# EAGLE design RL_P (EAGLE 9.6.2)
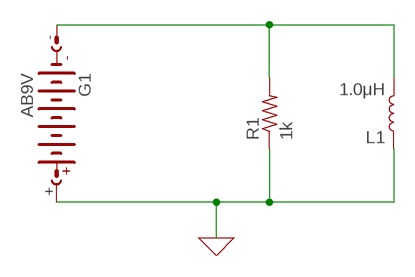
[diagram p0: schematic, sheet 1]

## Parts
G1  AB9V  [AB9V]
L1  1.0μH  1.0μH-0805_WIDE-1.0μH-1.4A-0.07OHM-1.4MM_H  [0805-WIDE]
R1  1k  R-US_0204/2V  [0204V]

## Nets
0: G1.+ L1.1 R1.1 ; supply symbol labelled GND
N$1: G1.- L1.2 R1.2

## Library data of the parts
G1 = battery:AB9V: 9-V BATTERY CLIP
L1 = SparkFun-Coils:1.0μH: 1.0μH Inductor Resist changes in electrical current. Basically a coil of wire. SparkFun Products: SparkFun Edge <https://www.sparkfun.com/products/15170>; PROD_ID: NDUC-14237
R1 = adafruit:R-US_: RESISTOR, American symbol

## Board
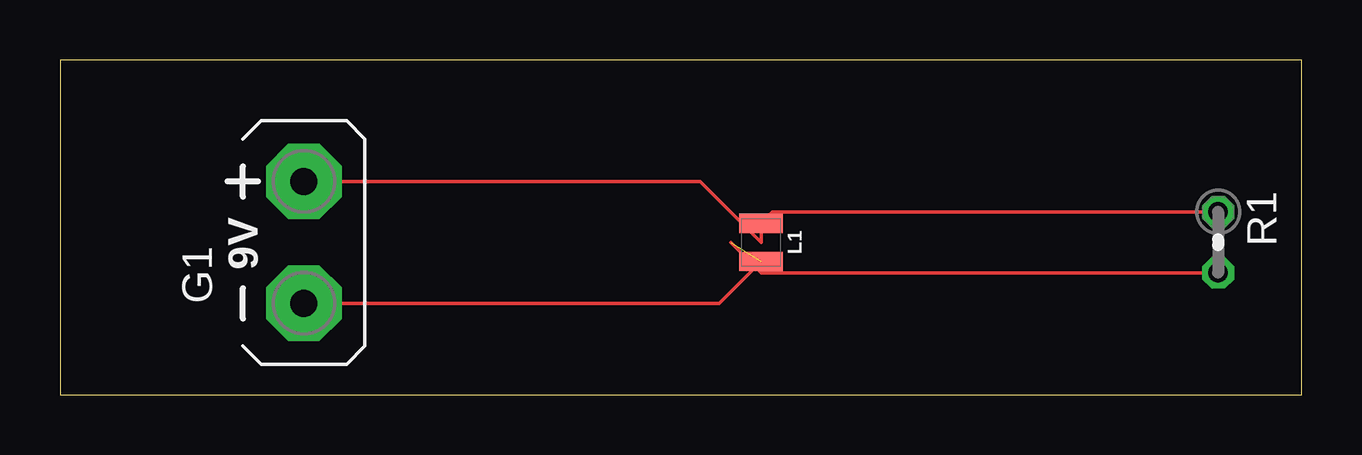
[diagram p1: board, top side]

Size 51.74 x 13.96 mm. Coordinates in mm from the lower left corner, seen from the top.
Outline: 0,0 51.74,0 51.74,13.96 0,13.96 0,0
Copper layers (1*16): Top 0.035mm / dielectric 1.5mm / Bottom 0.035mm
Design rules "default": minimum track width 6mil, minimum drill 0.35mm, track to track 6mil, track to pad 6mil, pad to pad 6mil, via to via 6mil, smd to smd 6mil, copper to edge 40mil, drill to drill 6mil, minimum pad ring 10mil, minimum via ring 8mil, stop-mask expansion 4mil, vias tented up to drill 0mil, thermal gap 10mil

### Footprints (pad centres in the part's own frame; a part is rotated, then mirrored left to right if it is on the bottom)
AB9V = drill 1.118 pad 3.15 octagon: + 0,2.54; - 0,-2.54
0805-WIDE = smd 0.8 x 1.8: 1 -0.8,0; 2 0.8,0
0204V = drill 0.813 octagon: 1 -1.27,0; 2 1.27,0

### Placement (x,y rotation side)
G1  10.16,6.35 0 top
L1  29.21,6.35 270 top
R1  48.26,6.35 270 top

### Tracks (layer width: path | path; a pad name or v marks a point on that pad's centre or on a via)
0
  Top 0.152: G1.+ 26.67,8.89 29.21,6.35 L1.1 29.68,7.62 R1.1
N$1  (1 unrouted)
  Top 0.152: G1.- 27.47,3.81 L1.2 | R1.2 29.21,5.08 27.94,6.35